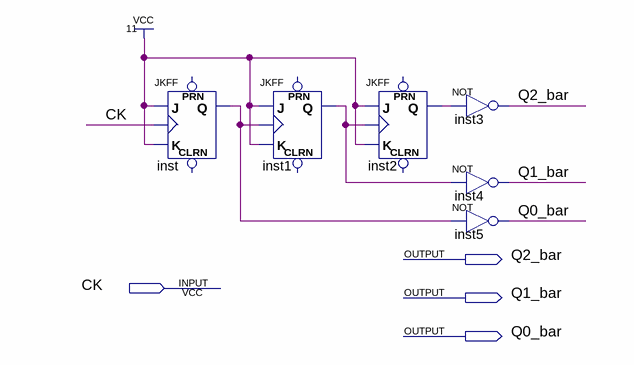
[diagram p0: schematic sheet]
// Quartus schematic 8_MOD_A_U_1.bdf as structural Verilog: 6 symbols, 4 pins
module \8_MOD_A_U_1  (
  input  CK,
  output Q2_bar,
  output Q1_bar,
  output Q0_bar
);

  wire inst1_q, inst2_q, inst_q;

  JKFF inst (.K(1'b1), .J(1'b1), .CLK(CK), .Q(inst_q));  // open: PRN, CLRN
  JKFF inst1 (.K(1'b1), .J(1'b1), .CLK(inst_q), .Q(inst1_q));  // open: PRN, CLRN
  JKFF inst2 (.K(1'b1), .J(1'b1), .CLK(inst1_q), .Q(inst2_q));  // open: PRN, CLRN
  not inst3 (Q2_bar, inst2_q);
  not inst4 (Q1_bar, inst1_q);
  not inst5 (Q0_bar, inst_q);
endmodule
